# Altium schematic sheet Signal_Connectors.SchDoc
size A4; SheetNumber: 10; SheetTotal: 10
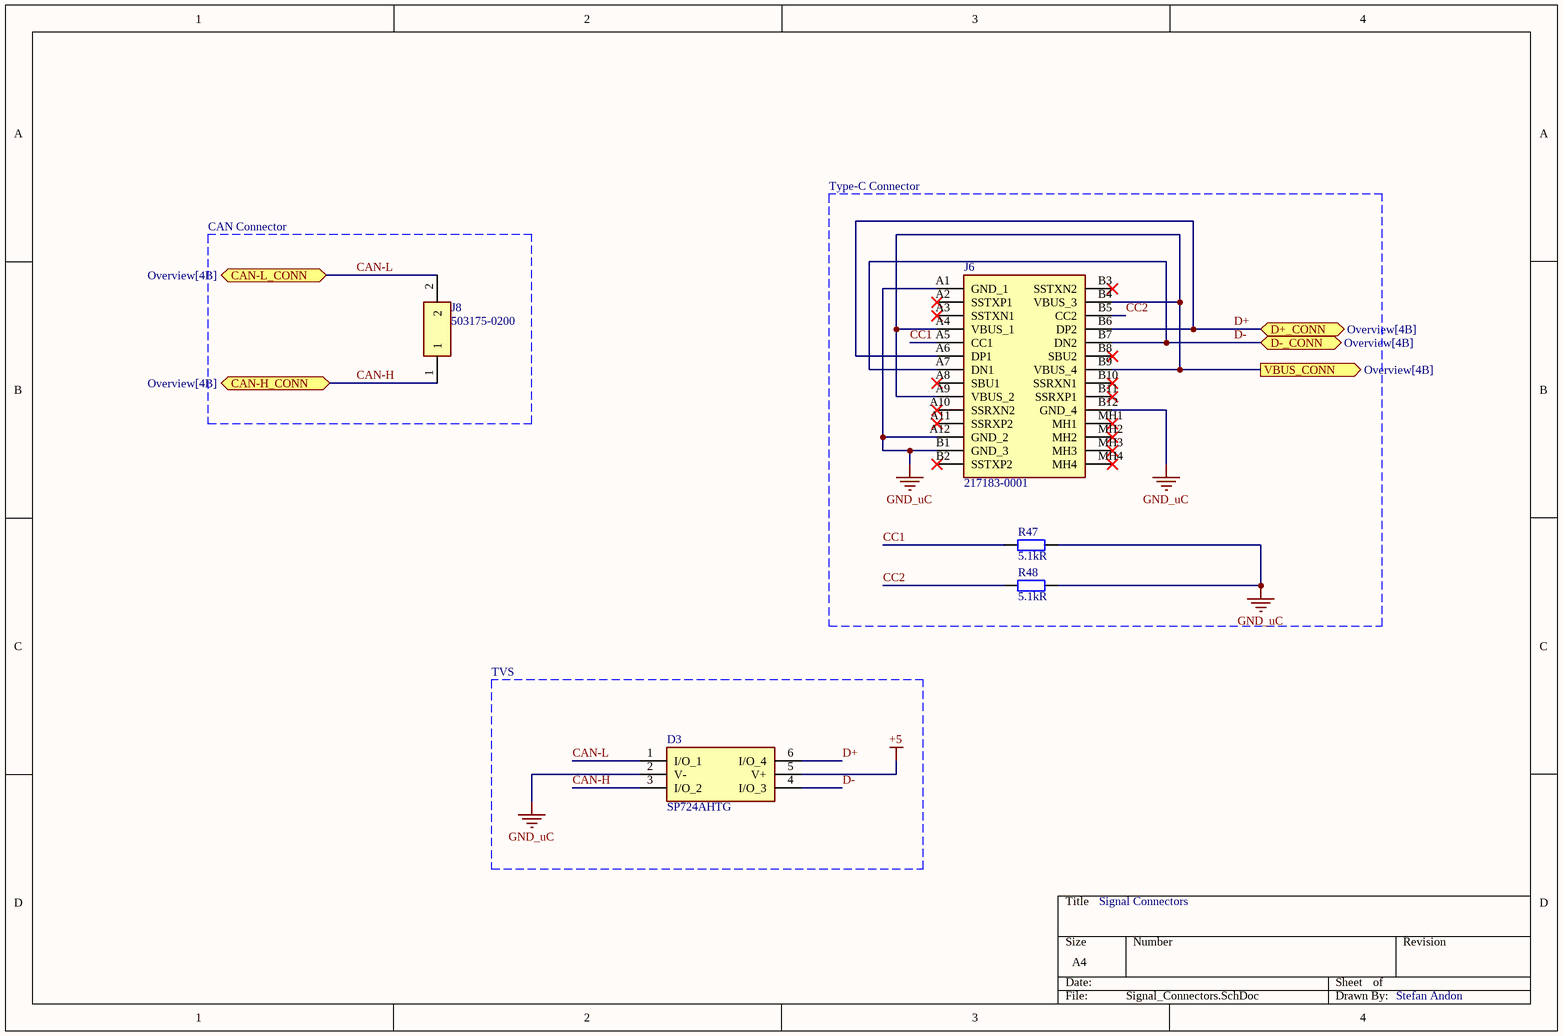
[diagram p0: Signal_Connectors.SchDoc]

## Parts
D3  SP724AHTG  [SOT95P280X145-6N]
J6  217183-0001  [2171830001]
J8  503175-0200  [5031750200]
R47  value 5.1kR  [RES_0603]  (hidden comment: Resistor_SMD)
R48  value 5.1kR  [RES_0603]  (hidden comment: Resistor_SMD)

## Blocks framed on the sheet
Type-C Connector: J6 R47 R48
CAN Connector: J8
TVS: D3

## Ports
CAN-H_CONN (bidir, see Overview[4B]), CAN-L_CONN (bidir, see Overview[4B]), D+_CONN (bidir, see Overview[4B]), D-_CONN (bidir, see Overview[4B]), VBUS_CONN (out, see Overview[4B])

## Nets
+5: D3.5(V+)
GND_uC: D3.2(V-) J6.A1(GND_1) J6.A12(GND_2) J6.B1(GND_3) J6.B12(GND_4) R47.1 R48.1
CAN-H: D3.3(I/O_2) J8.1 ; port CAN-H_CONN
CAN-L: D3.1(I/O_1) J8.2 ; port CAN-L_CONN
CC1: J6.A5(CC1) R47.2
CC2: J6.B5(CC2) R48.2
D+: D3.6(I/O_4) J6.A6(DP1) J6.B6(DP2) ; port D+_CONN
D-: D3.4(I/O_3) J6.A7(DN1) J6.B7(DN2) ; port D-_CONN
VBUS_CONN: J6.A4(VBUS_1) J6.A9(VBUS_2) J6.B4(VBUS_3) J6.B9(VBUS_4) ; port VBUS_CONN

Not connected (* = marked no-connect by the designer): J6 A2(SSTXP1)* A3(SSTXN1)* A8(SBU1)* A10(SSRXN2)* A11(SSRXP2)* B2(SSTXP2)* B3(SSTXN2)* B8(SBU2)* B10(SSRXN1)* B11(SSRXP1)* MH1* MH2* MH3* MH4*

## Notes on the sheet
- Signal Connectors
- Stefan Andon

## Library data of the parts
D3 = SP724AHTG: TVS Diode (Bi-directional); Manufacturer_Name: LITTELFUSE; Datasheet Link: https://www.littelfuse.com/~/media/electronics/datasheets/tvs_diode_arrays/littelfuse_tvs_diode_array_sp724_datasheet.pdf.pdf; Height: 1.45mm; Manufacturer_Part_Number: SP724AHTG; Mouser Part Number: 576-SP724AHTG; Mouser Price/Stock: https://www.mouser.co.uk/ProductDetail/Littelfuse/SP724AHTG?qs=FuFbM%252B3iO0xmrFuCe7QggQ%3D%3D
J6 = 217183-0001: Connector; Manufacturer_Name: Molex; Datasheet Link: https://www.molex.com/pdm_docs/sd/2171830001_sd.pdf; Height: 3.36mm; Manufacturer_Part_Number: 217183-0001; Mouser Part Number: 538-217183-0001; Mouser Price/Stock: https://www.mouser.co.uk/ProductDetail/Molex/217183-0001?qs=DRkmTr78QAQVjf9fqpgsow%3D%3D
J8 = 503175-0200: Connector; Manufacturer_Name: Molex; Height: 7.15mm; Manufacturer_Part_Number: 503175-0200; Mouser Part Number: 538-503175-0200; Mouser Price/Stock: https://www.mouser.co.uk/ProductDetail/Molex/503175-0200?qs=3OKVfsn1b5Bt3iMCrTKlBA%3D%3D
R47 R48 = CMP-001-0003-18: Tolerance: tbd; Power: 7W; BOM: Value+', '+Power+', '+Tolerance+', '+CurrentFootprint; Package: tbd